# EAGLE design ribbon2ftdi (EAGLE 7.3.0)
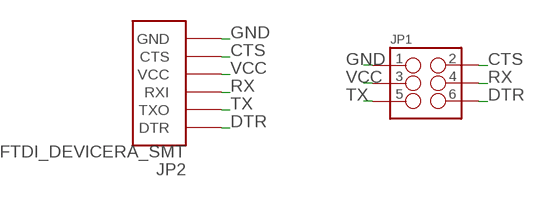
[diagram p0: schematic, sheet 1]

## Parts
JP1  M03X2SHROUD  [2X3-SHROUDED]
JP2  FTDI_DEVICERA_SMT  [FTDI_DEVICE_RA_SMT]

## Nets
CTS: JP1.2 JP2.5(CTS)
DTR: JP1.6 JP2.1(DTR)
GND: JP1.1 JP2.6(GND)
RX: JP1.4 JP2.3(RXI)
TX: JP1.5 JP2.2(TXO)
VCC: JP1.3 JP2.4(VCC)

## Library data of the parts
JP1 = SparkFun-Connectors:M03X2: 2x3 .1" header. Shrouded, with keying- CONN-10681 SMT- CONN-11415 Pogo pins- HW-11044; PROD_ID: CONN-10681
JP2 = SparkFun-Connectors:FTDI_DEVICE: Connector which mates to FTDI basic or FTDI cable.; PROD_ID: CONN-08971

## Board
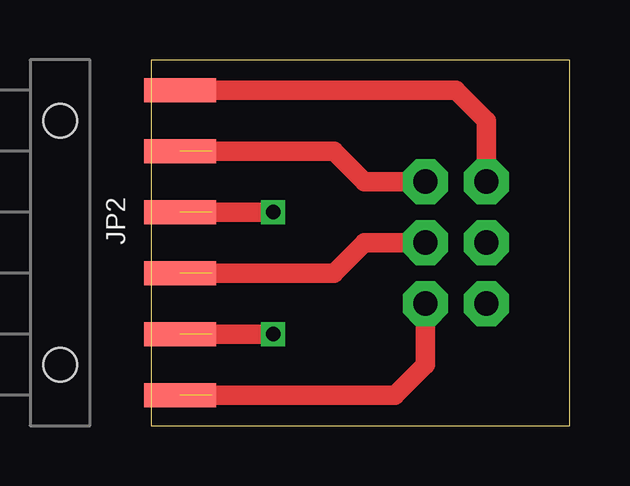
[diagram p1: board, top side]
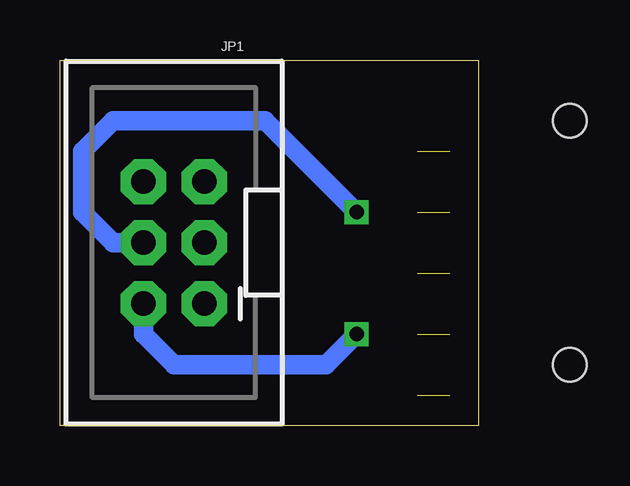
[diagram p2: board, bottom side, seen from below]

Size 17.45 x 15.23 mm. Coordinates in mm from the lower left corner, seen from the top.
Outline: 0,0 17.45,0 17.45,15.23 0,15.23 0,0
Copper layers (1*16): Top 0.035mm / dielectric 1.5mm / Bottom 0.035mm
Design rules "default": minimum track width 10mil, minimum drill 24mil, track to track 8mil, track to pad 8mil, pad to pad 8mil, via to via 8mil, smd to smd 8mil, copper to edge 40mil, drill to drill 8mil, minimum pad ring 10mil, minimum via ring 8mil, stop-mask expansion 4mil, vias tented up to drill 0mil, thermal gap 10mil

### Footprints (pad centres in the part's own frame; a part is rotated, then mirrored left to right if it is on the bottom)
2X3-SHROUDED = drill 1.016 pad 1.88 octagon: 1 -1.27,2.54; 2 1.27,2.54; 3 -1.27,0; 4 1.27,0; 5 -1.27,-2.54; 6 1.27,-2.54
FTDI_DEVICE_RA_SMT = smd 1 x 3: 1 -6.35,5; 2 -3.81,5; 3 -1.27,5; 4 1.27,5; 5 3.81,5; 6 6.35,5 | hole 1.4: -5.08,0; 5.08,0

### Placement (x,y rotation side)
JP1  12.7,7.62 180 bottom
JP2  -3.81,7.62 270 top

### Tracks (layer width: path | path; a pad name or v marks a point on that pad's centre or on a via)
CTS  (via drill 0.6 pad 0.81)  (1 unrouted)
  Top 0.813: v5.08,3.81 2.54,3.81
  Bottom 0.813: JP1.2 13.97,3.81 12.7,2.54 6.35,2.54 v5.08,3.81
DTR
  Top 0.813: JP2.1 12.7,13.97 13.97,12.7 JP1.6
GND  (1 unrouted)
  Top 0.813: JP1.1 11.43,2.54 10.16,1.27 2.54,1.27
RX  (via drill 0.6 pad 0.81)  (1 unrouted)
  Top 0.813: v5.08,8.89 2.54,8.89
  Bottom 0.813: JP1.4 15.24,7.62 16.51,8.89 16.51,11.43 15.24,12.7 8.89,12.7 v5.08,8.89
TX  (1 unrouted)
  Top 0.813: JP1.5 8.89,10.16 7.62,11.43 2.54,11.43
VCC  (1 unrouted)
  Top 0.813: JP1.3 8.89,7.62 7.62,6.35 2.54,6.35